# Altium schematic sheet XSA.SchDoc
size A
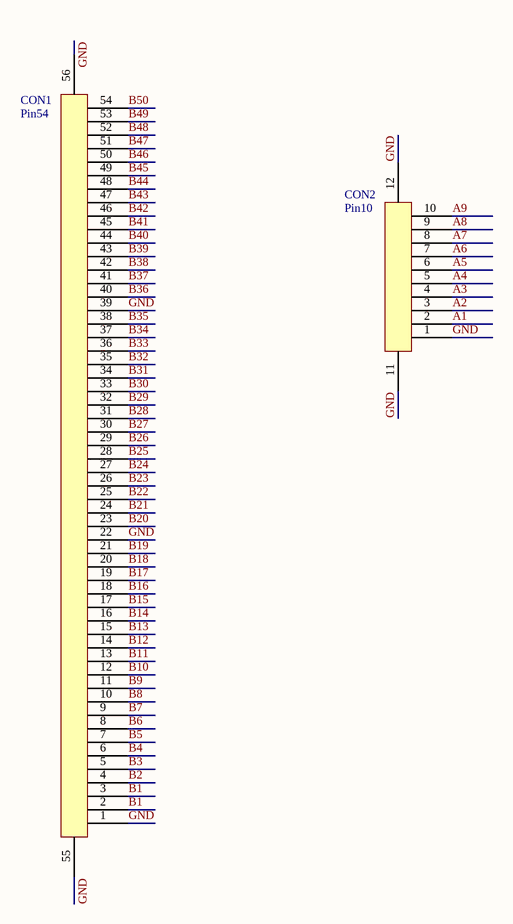
[diagram p0: XSA.SchDoc]

## Parts
CON1  Pin54  [Pin54]
CON2  Pin10  [Pin10]

## Nets
A1: CON2.2
A2: CON2.3
A3: CON2.4
A4: CON2.5
A5: CON2.6
A6: CON2.7
A7: CON2.8
A8: CON2.9
A9: CON2.10
B1: CON1.2 CON1.3
B2: CON1.4
B3: CON1.5
B4: CON1.6
B5: CON1.7
B6: CON1.8
B7: CON1.9
B8: CON1.10
B9: CON1.11
B10: CON1.12
B11: CON1.13
B12: CON1.14
B13: CON1.15
B14: CON1.16
B15: CON1.17
B16: CON1.18
B17: CON1.19
B18: CON1.20
B19: CON1.21
B20: CON1.23
B21: CON1.24
B22: CON1.25
B23: CON1.26
B24: CON1.27
B25: CON1.28
B26: CON1.29
B27: CON1.30
B28: CON1.31
B29: CON1.32
B30: CON1.33
B31: CON1.34
B32: CON1.35
B33: CON1.36
B34: CON1.37
B35: CON1.38
B36: CON1.40
B37: CON1.41
B38: CON1.42
B39: CON1.43
B40: CON1.44
B41: CON1.45
B42: CON1.46
B43: CON1.47
B44: CON1.48
B45: CON1.49
B46: CON1.50
B47: CON1.51
B48: CON1.52
B49: CON1.53
B50: CON1.54
GND: CON1.1 CON1.22 CON1.39 CON1.55 CON1.56 CON2.1 CON2.11 CON2.12